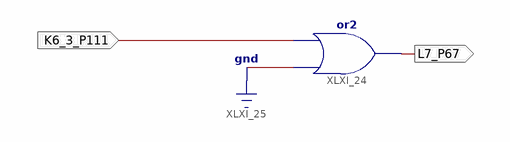
[diagram p0: schematic sheet 1]
// Xilinx ISE schematic test.sch (spartan6) as structural Verilog: 1 symbols, 2 ports
module test (
  input  K6_3_P111,
  output L7_P67
);

  or XLXI_24 (L7_P67, 1'b0, K6_3_P111);
endmodule
